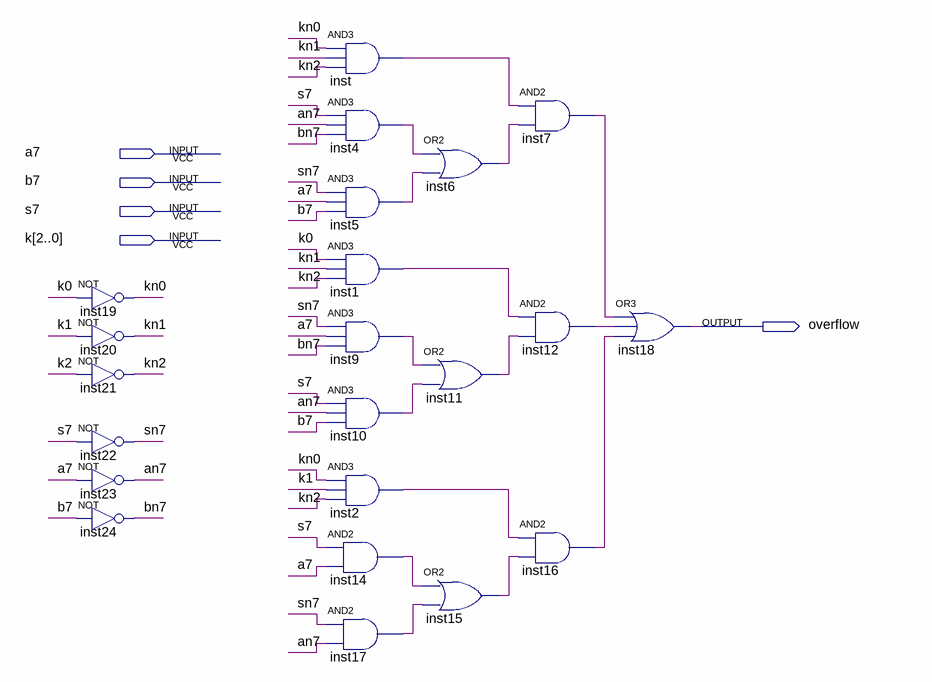
[diagram p0: schematic sheet]
// Quartus schematic overflow_check.bdf as structural Verilog: 22 symbols, 5 pins
module overflow_check (
  input  a7,
  input  b7,
  input  s7,
  input  [2:0] k,
  output overflow
);

  wire an7, bn7, inst1_out, inst2_out, inst4_out, inst5_out, inst6_out, inst7_out, inst9_out, inst10_out,
       inst11_out, inst12_out, inst14_out, inst15_out, inst16_out, inst17_out, inst_out, kn0, kn1, kn2, sn7;

  not inst19 (kn0, k[0]);
  not inst20 (kn1, k[1]);
  not inst21 (kn2, k[2]);
  not inst22 (sn7, s7);
  not inst23 (an7, a7);
  not inst24 (bn7, b7);
  and inst (inst_out, kn0, kn1, kn2);
  and inst4 (inst4_out, s7, an7, bn7);
  and inst5 (inst5_out, sn7, a7, b7);
  and inst1 (inst1_out, k[0], kn1, kn2);
  and inst9 (inst9_out, sn7, a7, bn7);
  and inst10 (inst10_out, s7, an7, b7);
  and inst2 (inst2_out, kn0, k[1], kn2);
  and inst14 (inst14_out, s7, a7);
  and inst17 (inst17_out, sn7, an7);
  or inst6 (inst6_out, inst4_out, inst5_out);
  or inst11 (inst11_out, inst9_out, inst10_out);
  or inst15 (inst15_out, inst14_out, inst17_out);
  and inst7 (inst7_out, inst_out, inst6_out);
  and inst12 (inst12_out, inst1_out, inst11_out);
  and inst16 (inst16_out, inst2_out, inst15_out);
  or inst18 (overflow, inst7_out, inst12_out, inst16_out);
endmodule
